# Altium project PCB_Project1.PrjPCB
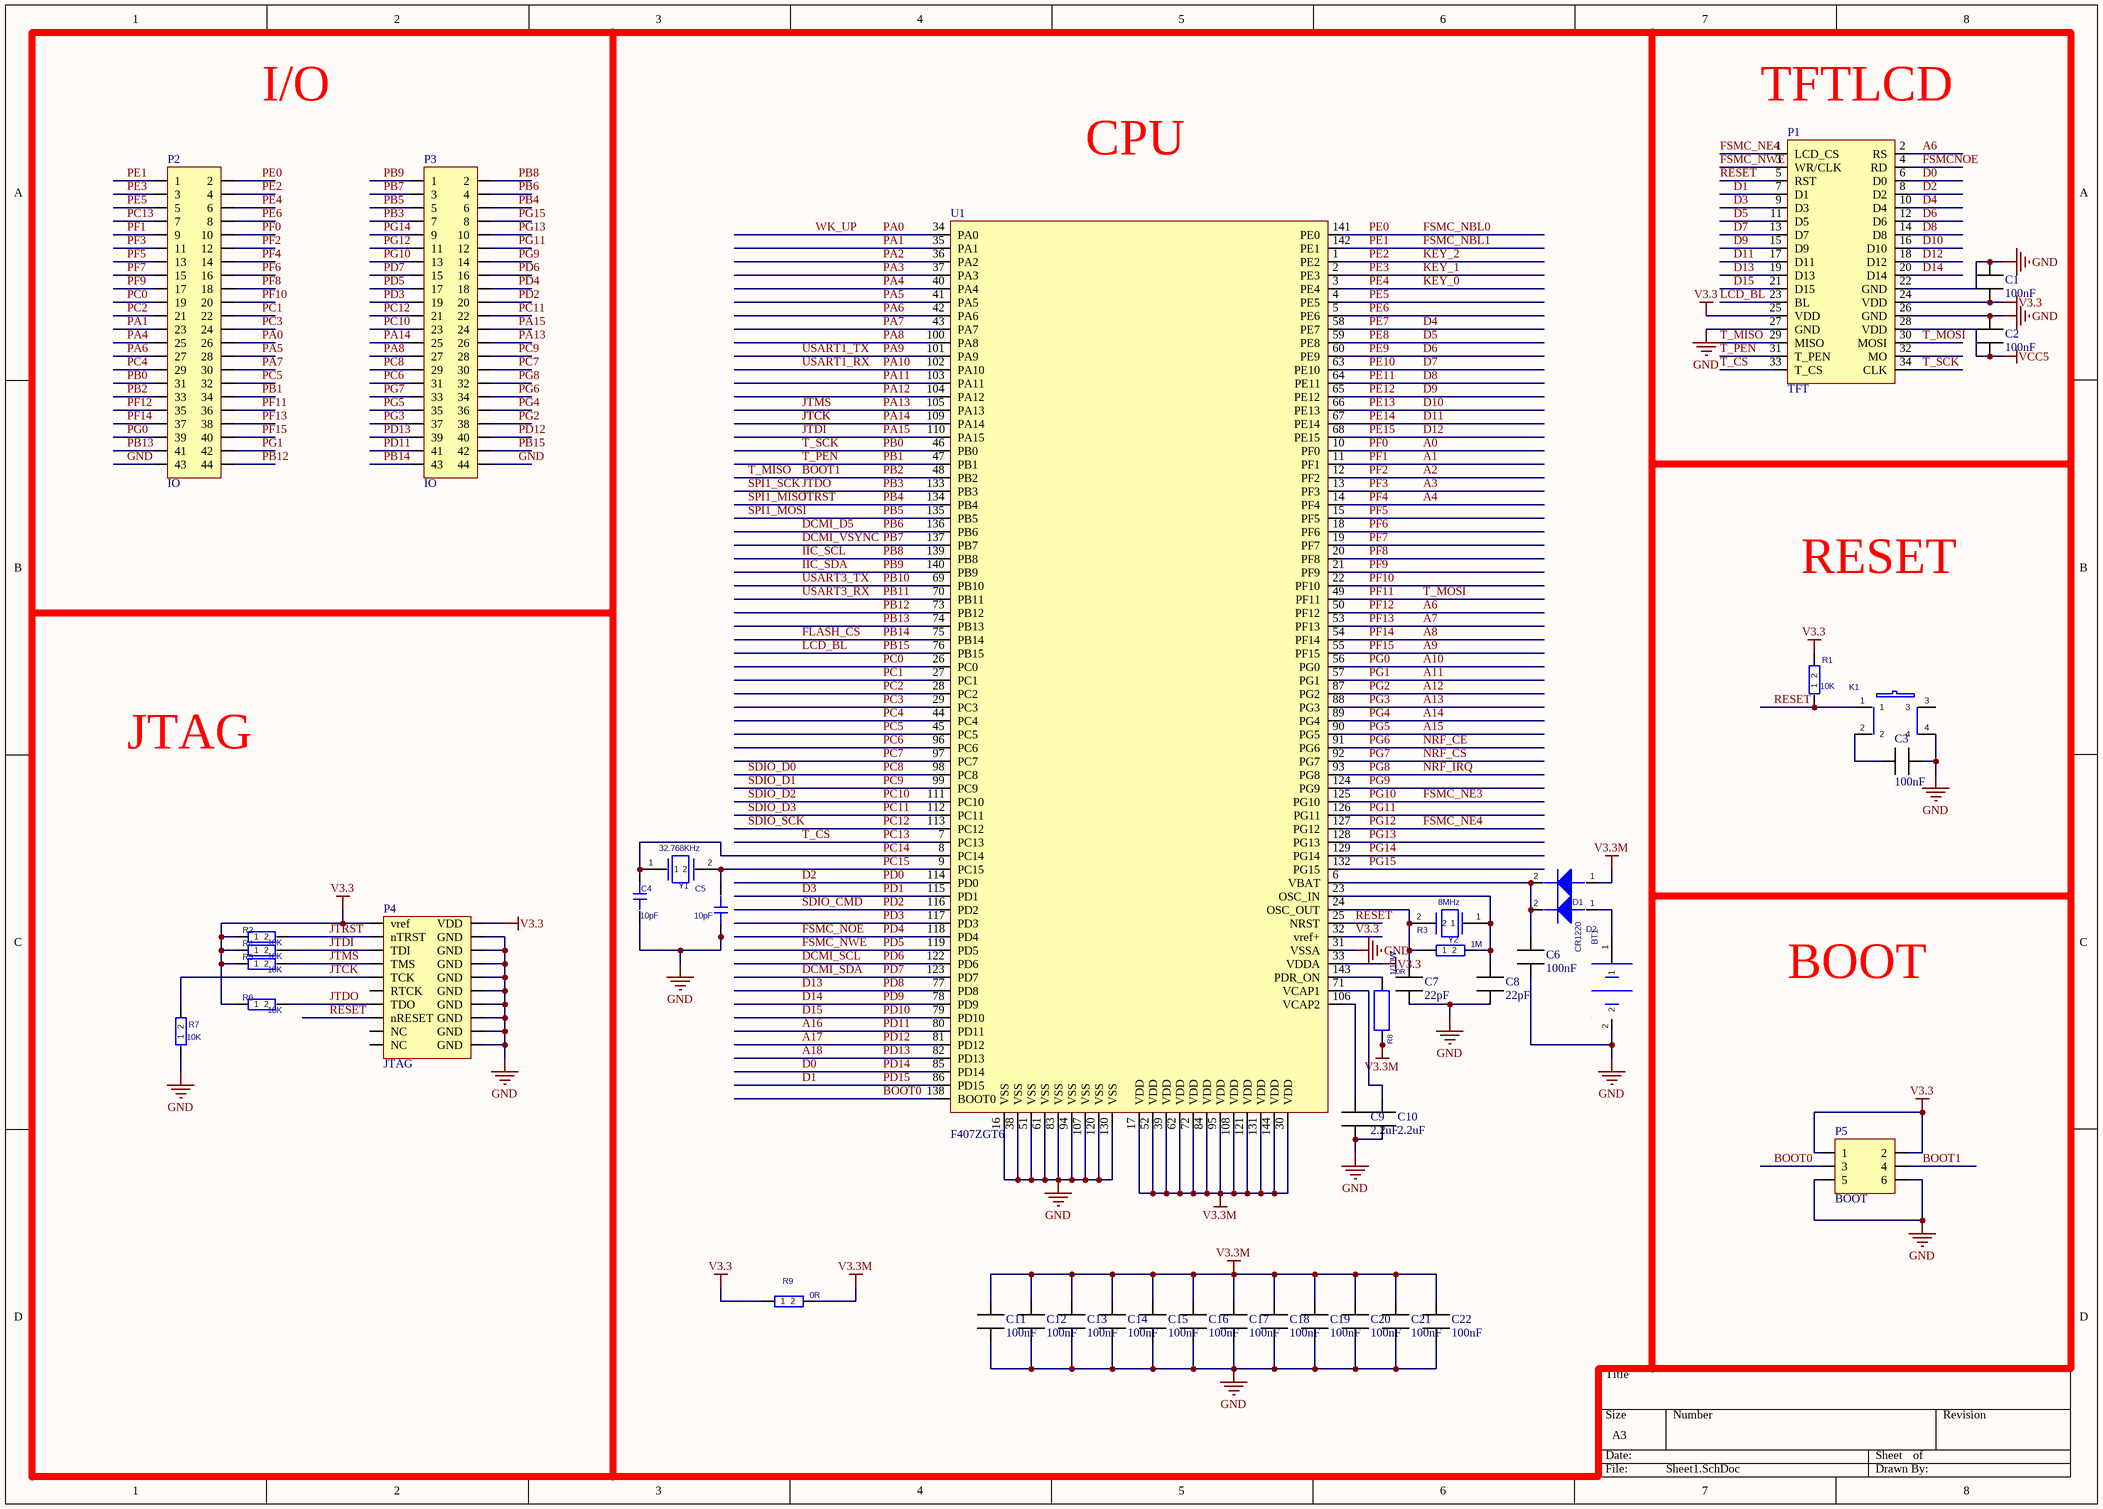
[diagram p0: Sheet1.SchDoc]
2 sheets, 88 parts. Net scope: global (net labels, ports and power ports of the same name join across sheets).
Board file: F407ZGT6.PcbDoc
Sheets:
  Sheet1.SchDoc
  Sheet2.SchDoc

## Sheet Sheet1.SchDoc
size A3

### Parts
BT1  CR1220  [BATERY]
C1  100nF  [CAP_0603_FIRE]
C2  100nF  [CAP_0603_FIRE]
C3  100nF  [CAP_0603_FIRE]
C4  value 10pF  [CAP_0603_FIRE]  (hidden comment: CAP_0.1UF_0603_FIRE)
C5  value 10pF  [CAP_0603_FIRE]  (hidden comment: CAP_0.1UF_0603_FIRE)
C6  100nF  [CAP_0603_FIRE]
C7  22pF  [CAP_0603_FIRE]
C8  22pF  [CAP_0603_FIRE]
C9  2.2uF  [CAP_0603_FIRE]
C10  2.2uF  [CAP_0603_FIRE]
C11  100nF  [CAP_0603_FIRE]
C12  100nF  [CAP_0603_FIRE]
C13  100nF  [CAP_0603_FIRE]
C14  100nF  [CAP_0603_FIRE]
C15  100nF  [CAP_0603_FIRE]
C16  100nF  [CAP_0603_FIRE]
C17  100nF  [CAP_0603_FIRE]
C18  100nF  [CAP_0603_FIRE]
C19  100nF  [CAP_0603_FIRE]
C20  100nF  [CAP_0603_FIRE]
C21  100nF  [CAP_0603_FIRE]
C22  100nF  [CAP_0603_FIRE]
D1  IN4148  [DIODE_SOP]  (value not drawn)
D2  IN4148  [DIODE_SOP]  (value not drawn)
K1  KEY  [SW6.2/6.2-SMD]  (value not drawn)
P1  TFT  [TFT]
P2  IO  [HEAD2*22]
P3  IO  [HEAD2*22]
P4  JTAG  [FC20H]
P5  BOOT  [BOOT]
R1  value 10K  [RES_0603_FIRE]  (hidden comment: RES_1K_0603_FIRE)
R2  value 10K  [RES_0603_FIRE]  (hidden comment: RES_10K_0603_FIRE)
R3  value 1M  [RES_0603_FIRE]  (hidden comment: RES_1K_0603_FIRE)
R4  value 10K  [RES_0603_FIRE]  (hidden comment: RES_10K_0603_FIRE)
R5  value 10K  [RES_0603_FIRE]  (hidden comment: RES_10K_0603_FIRE)
R6  value 10K  [RES_0603_FIRE]  (hidden comment: RES_10K_0603_FIRE)
R7  value 10K  [RES_0603_FIRE]  (hidden comment: RES_10K_0603_FIRE)
R8  value 0R  Power: 1/10W  [0603]  (hidden comment: RES-0603-0R)
R9  value 0R  [RES_0603_FIRE]  (hidden comment: RES_1K_0603_FIRE)
U1  F407ZGT6  [STM32F407ZGT6]
Y1  value 32.768KHz  [CRYS-3X8]  (hidden comment: XTAL_32.768KHZ_FIRE)
Y2  value 8MHz  [CRYSTAL_SMD_FIRE]  (hidden comment: XTAL_8M_FIRE)

### Nets
GND: BT1.2 C1.2 C2.2 C3.1 C4.1 C5.1 C6.1 C7.1 C8.1 C9.1 C10.1 C11.1 C12.1 C13.1 C14.1 C15.1 C16.1 C17.1 C18.1 C19.1 C20.1 C21.1 C22.1 K1.4 P1.22(GND) P1.26(GND) P1.27(GND) P2.43 P3.44 P4.4(GND) P4.6(GND) P4.8(GND) P4.10(GND) P4.12(GND) P4.14(GND) P4.16(GND) P4.18(GND) P4.20(GND) P5.5 P5.6 R7.1 U1.16(VSS) U1.31(VSSA) U1.38(VSS) U1.51(VSS) U1.61(VSS) U1.83(VSS) U1.94(VSS) U1.107(VSS) U1.120(VSS) U1.130(VSS)
V3.3: C1.1 P1.24(VDD) P1.25(VDD) P4.1(vref) P4.2(VDD) P5.1 P5.2 R1.2 R2.1 R4.1 R5.1 R6.1 R9.1 U1.32(vref+) U1.33(VDDA)
V3.3M: C11.2 C12.2 C13.2 C14.2 C15.2 C16.2 C17.2 C18.2 C19.2 C20.2 C21.2 C22.2 D1.1(+) R8.1 R9.2 U1.17(VDD) U1.30(VDD) U1.39(VDD) U1.52(VDD) U1.62(VDD) U1.72(VDD) U1.84(VDD) U1.95(VDD) U1.108(VDD) U1.121(VDD) U1.131(VDD) U1.144(VDD)
VCC5: C2.1 P1.28(VDD)
A0: P2.10 U1.10(PF0)  [also labelled PF0]
A1: P2.9 U1.11(PF1)  [also labelled PF1]
A2: P2.12 U1.12(PF2)  [also labelled PF2]
A3: P2.11 U1.13(PF3)  [also labelled PF3]
A4: P2.14 U1.14(PF4)  [also labelled PF4]
A6: P1.2(RS) P2.35 U1.50(PF12)  [also labelled PF12]
A7: P2.38 U1.53(PF13)  [also labelled PF13]
A8: P2.37 U1.54(PF14)  [also labelled PF14]
A9: P2.40 U1.55(PF15)  [also labelled PF15]
A10: P2.39 U1.56(PG0)  [also labelled PG0]
A11: P2.42 U1.57(PG1)  [also labelled PG1]
A12: P3.38 U1.87(PG2)  [also labelled PG2]
A13: P3.37 U1.88(PG3)  [also labelled PG3]
A14: P3.36 U1.89(PG4)  [also labelled PG4]
A15: P3.35 U1.90(PG5)  [also labelled PG5]
A16: P3.41 U1.80(PD11)  [also labelled PD11]
A17: P3.40 U1.81(PD12)  [also labelled PD12]
A18: P3.39 U1.82(PD13)  [also labelled PD13]
BOOT0: P5.3 U1.138(BOOT0)
BOOT1: P1.29(MISO) P2.33 P5.4 U1.48(PB2)  [also labelled PB2, T_MISO]
D0: P1.6(D0) U1.85(PD14)  [also labelled PD14]
D1: P1.7(D1) U1.86(PD15)  [also labelled PD15]
D2: P1.8(D2) U1.114(PD0)  [also labelled PD0]
D3: P1.9(D3) U1.115(PD1)  [also labelled PD1]
D4: P1.10(D4) U1.58(PE7)  [also labelled PE7]
D5: P1.11(D5) U1.59(PE8)  [also labelled PE8]
D6: P1.12(D6) U1.60(PE9)  [also labelled PE9]
D7: P1.13(D7) U1.63(PE10)  [also labelled PE10]
D8: P1.14(D8) U1.64(PE11)  [also labelled PE11]
D9: P1.15(D9) U1.65(PE12)  [also labelled PE12]
D10: P1.16(D10) U1.66(PE13)  [also labelled PE13]
D11: P1.17(D11) U1.67(PE14)  [also labelled PE14]
D12: P1.18(D12) U1.68(PE15)  [also labelled PE15]
D13: P1.19(D13) U1.77(PD8)  [also labelled PD8]
D14: P1.20(D14) U1.78(PD9)  [also labelled PD9]
D15: P1.21(D15) U1.79(PD10)  [also labelled PD10]
DCMI_D5: P3.4 U1.136(PB6)  [also labelled PB6]
DCMI_SCL: P3.16 U1.122(PD6)  [also labelled PD6]
DCMI_SDA: P3.15 U1.123(PD7)  [also labelled PD7]
DCMI_VSYNC: P3.3 U1.137(PB7)  [also labelled PB7]
FLASH_CS: P3.43 U1.75(PB14)  [also labelled PB14]
FSMC_NBL0: P2.2 U1.141(PE0)  [also labelled PE0]
FSMC_NBL1: P2.1 U1.142(PE1)  [also labelled PE1]
FSMC_NE3: P3.13 U1.125(PG10)  [also labelled PG10]
FSMC_NE4: P1.1(LCD_CS) P3.11 U1.127(PG12)  [also labelled PG12]
FSMC_NOE: P3.18 U1.118(PD4)  [also labelled PD4]
FSMC_NWE: P1.3(WR/CLK) P3.17 U1.119(PD5)  [also labelled PD5]
FSMCNOE: P1.4(RD)
IIC_SCL: P3.2 U1.139(PB8)  [also labelled PB8]
IIC_SDA: P3.1 U1.140(PB9)  [also labelled PB9]
JTCK: P3.25 P4.9(TCK) R7.2 U1.109(PA14)  [also labelled PA14]
JTDI: P3.24 P4.5(TDI) R4.2 U1.110(PA15)  [also labelled PA15]
JTDO: P3.7 P4.13(TDO) R6.2 U1.133(PB3)  [also labelled PB3, SPI1_SCK]
JTMS: P3.26 P4.7(TMS) R5.2 U1.105(PA13)  [also labelled PA13]
JTRST: P3.6 P4.3(nTRST) R2.2 U1.134(PB4)  [also labelled PB4, SPI1_MISO]
KEY_0: P2.6 U1.3(PE4)  [also labelled PE4]
KEY_1: P2.3 U1.2(PE3)  [also labelled PE3]
KEY_2: P2.4 U1.1(PE2)  [also labelled PE2]
LCD_BL: P1.23(BL) P3.42 U1.76(PB15)  [also labelled PB15]
NRF_CE: P3.34 U1.91(PG6)  [also labelled PG6]
NRF_CS: P3.33 U1.92(PG7)  [also labelled PG7]
NRF_IRQ: P3.32 U1.93(PG8)  [also labelled PG8]
PA0: P2.26 U1.34(PA0)  [also labelled WK_UP]
PA1: P2.23 U1.35(PA1)
PA2: U1.36(PA2)
PA3: U1.37(PA3)
PA4: P2.25 U1.40(PA4)
PA5: P2.28 U1.41(PA5)
PA6: P2.27 U1.42(PA6)
PA7: P2.30 U1.43(PA7)
PA8: P3.27 U1.100(PA8)
PA9: U1.101(PA9)  [also labelled USART1_TX]
PA10: U1.102(PA10)  [also labelled USART1_RX]
PA11: U1.103(PA11)
PA12: U1.104(PA12)
PB0: P1.34(CLK) P2.31 U1.46(PB0)  [also labelled T_SCK]
PB1: P1.31(T_PEN) P2.34 U1.47(PB1)  [also labelled T_PEN]
PB5: P3.5 U1.135(PB5)  [also labelled SPI1_MOSI]
PB10: U1.69(PB10)  [also labelled USART3_TX]
PB11: U1.70(PB11)  [also labelled USART3_RX]
PB12: P2.44 U1.73(PB12)
PB13: P2.41 U1.74(PB13)
PC0: P2.19 U1.26(PC0)
PC1: P2.22 U1.27(PC1)
PC2: P2.21 U1.28(PC2)
PC3: P2.24 U1.29(PC3)
PC4: P2.29 U1.44(PC4)
PC5: P2.32 U1.45(PC5)
PC6: P3.31 U1.96(PC6)
PC7: P3.30 U1.97(PC7)
PC8: P3.29 U1.98(PC8)  [also labelled SDIO_D0]
PC9: P3.28 U1.99(PC9)  [also labelled SDIO_D1]
PC10: P3.23 U1.111(PC10)  [also labelled SDIO_D2]
PC11: P3.22 U1.112(PC11)  [also labelled SDIO_D3]
PC12: P3.21 U1.113(PC12)  [also labelled SDIO_SCK]
PC13: P1.33(T_CS) P2.7 U1.7(PC13)  [also labelled T_CS]
PC14: C4.2 U1.8(PC14) Y1.1
PC15: C5.2 U1.9(PC15) Y1.2
PD2: P3.20 U1.116(PD2)  [also labelled SDIO_CMD]
PD3: P3.19 U1.117(PD3)
PE5: P2.5 U1.4(PE5)
PE6: P2.8 U1.5(PE6)
PF5: P2.13 U1.15(PF5)
PF6: P2.16 U1.18(PF6)
PF7: P2.15 U1.19(PF7)
PF8: P2.18 U1.20(PF8)
PF9: P2.17 U1.21(PF9)
PF10: P2.20 U1.22(PF10)
PF11: P1.30(MOSI) P2.36 U1.49(PF11)  [also labelled T_MOSI]
PG9: P3.14 U1.124(PG9)
PG11: P3.12 U1.126(PG11)
PG13: P3.10 U1.128(PG13)
PG14: P3.9 U1.129(PG14)
PG15: P3.8 U1.132(PG15)
RESET: K1.1 P1.5(RST) P4.15(nRESET) R1.1 U1.25(NRST)
NetBT1_1: BT1.1 D2.1(+)
NetC3_2: C3.2 K1.2
NetC6_2: C6.2 D1.2(-) D2.2(-) U1.6(VBAT)
NetC7_2: C7.2 R3.1 U1.24(OSC_OUT) Y2.2
NetC8_2: C8.2 R3.2 U1.23(OSC_IN) Y2.1
NetC9_2: C9.2 U1.106(VCAP2)
NetC10_2: C10.2 U1.71(VCAP1)
NetR8_2: R8.2 U1.143(PDR_ON)

Not connected (* = marked no-connect by the designer): K1 3; P1 32(MO); P4 11(RTCK) 17(NC) 19(NC)

### Notes on the sheet
- I/O
- (near P1) TFTLCD
- CPU
- RESET
- JTAG
- BOOT

### Library data of the parts
C1-C3 C6-C22 = CAP
C4 C5 = CAP_0.1UF_0603_FIRE: SURFACE MOUNT CAPACITOR 0.031 X 0.061 INCHES; PCB DECAL: CAP_0603_FIRE
R1 R3 R9 = RES_1K_0603_FIRE: 0402; Manufacture 1: SUPEROHM; Tolerance: +-5%; Assembly: SMD; PCB DECAL: RES_0603_FIRE
R2 R4-R7 = RES_10K_0603_FIRE: SURFACE MOUNT RESISTOR 0.031 X 0.061 INCHES, 1/10W; Assembly: SMD; PCB DECAL: RES_0603_FIRE
R8 = RES-0603-0R: 0603, 50V, 1/10W, 5%; Partname: 贴片电阻 0603; Part_Number: RE200045-01; Mfr_Part_Number: RS03K104JT; Mfr: Fenghua; Spec: 0R,1/10W,5%,RS03K104JT(风华); Remarks: Checked; Gtech_Number: 50106031003JR1001; Source_Path: D:\CADENCELIB\CAPTURELIB\LC_PASSIVE.OLB; PCB DECAL: 0603; Availability: 0
Y1 = XTAL_32.768KHZ_FIRE: CRYSTAL; PCB DECAL: CRYS-3X8
Y2 = XTAL_8M_FIRE: CRYSTAL; PCB DECAL: CRYSTAL_SMD_FIRE
BT1 = CR1220: PCB DECAL: BATERY
D1 D2 = IN4148: PCB DECAL: DIODE_SOP
K1 = KEY: Manufacturer #1 PN: KEY; PCB DECAL: SW6.2/6.2-SMD

## Sheet Sheet2.SchDoc
size A4
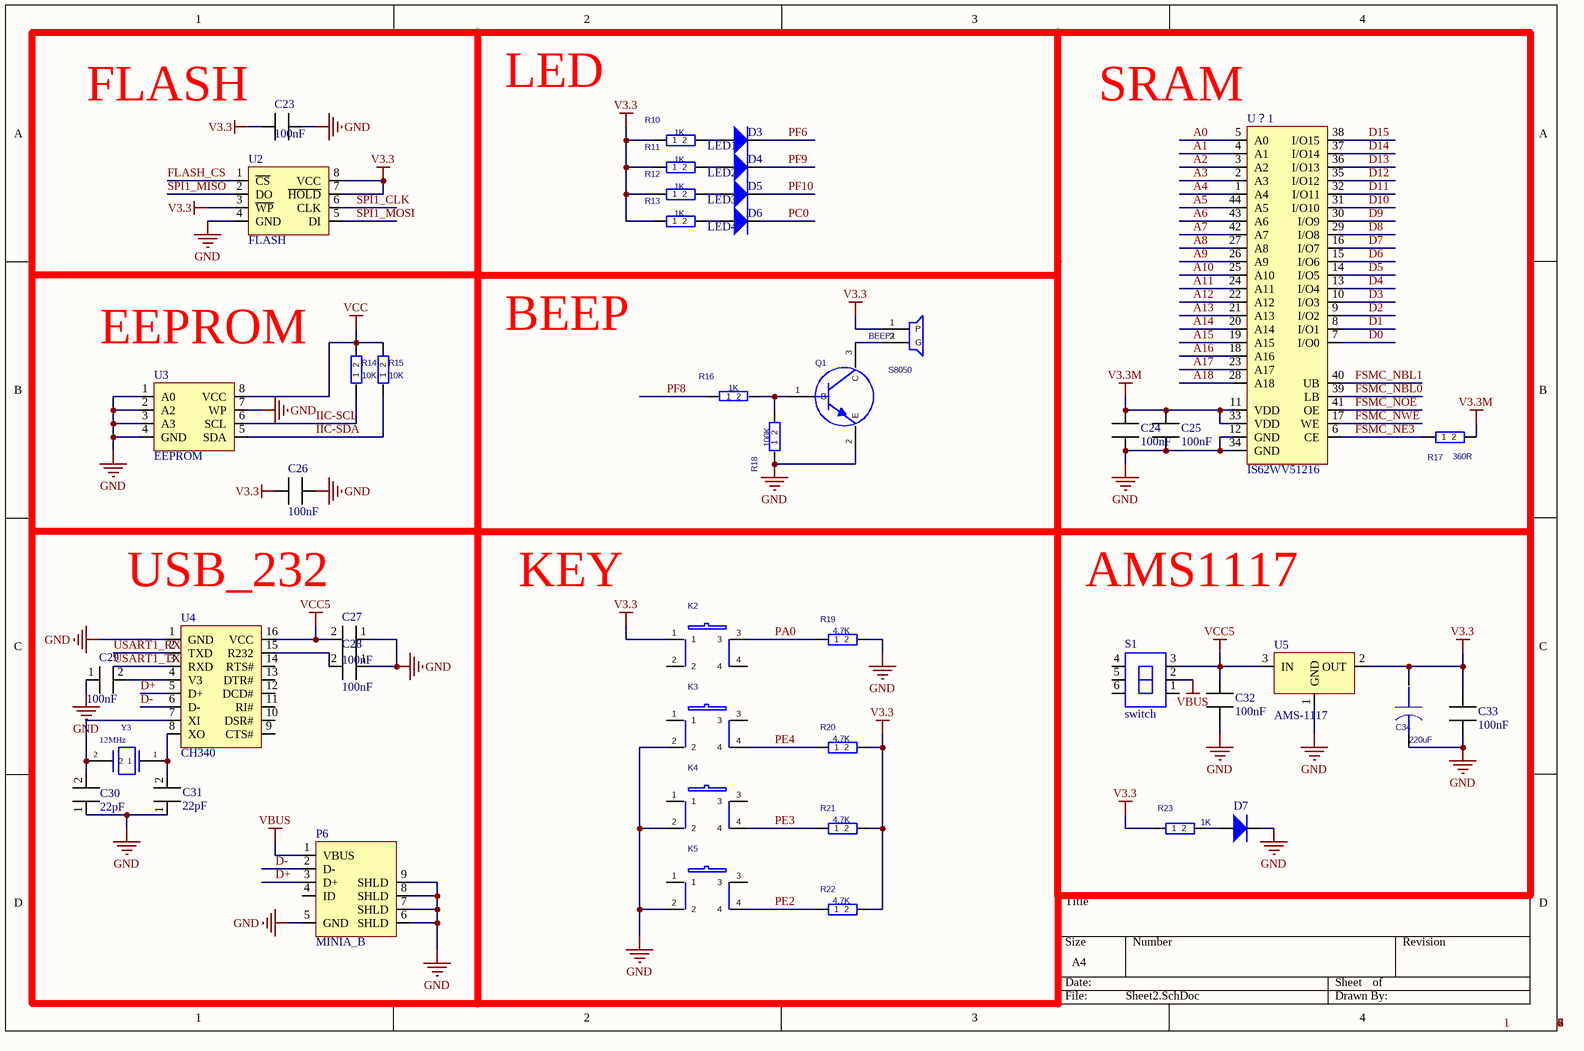
[diagram p1: Sheet2.SchDoc]

### Parts
BEEP1  BEEP-9.5X5.5  [BEEP-9.5X5.5]  (value not drawn)
C23  100nF  [CAP_0603_FIRE]
C24  100nF  [CAP_0603_FIRE]
C25  100nF  [CAP_0603_FIRE]
C26  100nF  [CAP_0603_FIRE]
C27  100nF  [CAP_0603_FIRE]
C28  100nF  [CAP_0603_FIRE]
C29  100nF  [CAP_0603_FIRE]
C30  22pF  [CAP_0603_FIRE]
C31  22pF  [CAP_0603_FIRE]
C32  100nF  [CAP_0603_FIRE]
C33  100nF  [CAP_0603_FIRE]
C34  value 220uF  [CAP+_47UF_FIRE]  (hidden comment: CAP+_47UF_FIRE)
D3  LED1  [DIODE_SOP]
D4  LED2  [DIODE_SOP]
D5  LED3  [DIODE_SOP]
D6  LED4  [DIODE_SOP]
D7  (no value)  [DIODE_SOP]
K2  KEY  [SW6.2/6.2-SMD]  (value not drawn)
K3  KEY  [SW6.2/6.2-SMD]  (value not drawn)
K4  KEY  [SW6.2/6.2-SMD]  (value not drawn)
K5  KEY  [SW6.2/6.2-SMD]  (value not drawn)
P6  MINIA_B  [USB-MINI]
Q1  S8050  [SOT-23]
R10  value 1K  [RES_0603_FIRE]  (hidden comment: RES_1K_0603_FIRE)
R11  value 1K  [RES_0603_FIRE]  (hidden comment: RES_1K_0603_FIRE)
R12  value 1K  [RES_0603_FIRE]  (hidden comment: RES_1K_0603_FIRE)
R13  value 1K  [RES_0603_FIRE]  (hidden comment: RES_1K_0603_FIRE)
R14  value 10K  [RES_0603_FIRE]  (hidden comment: RES_10K_0603_FIRE)
R15  value 10K  [RES_0603_FIRE]  (hidden comment: RES_10K_0603_FIRE)
R16  value 1K  [RES_0603_FIRE]  (hidden comment: RES_100R_0603_FIRE)
R17  value 360R  [RES_0603_FIRE]  (hidden comment: RES_1K_0603_FIRE)
R18  value 100K  [RES_0603_FIRE]  (hidden comment: RES_1K_0603_FIRE)
R19  value 4.7K  [RES_0603_FIRE]  (hidden comment: RES_4K7_0603_FIRE)
R20  value 4.7K  [RES_0603_FIRE]  (hidden comment: RES_4K7_0603_FIRE)
R21  value 4.7K  [RES_0603_FIRE]  (hidden comment: RES_4K7_0603_FIRE)
R22  value 4.7K  [RES_0603_FIRE]  (hidden comment: RES_4K7_0603_FIRE)
R23  value 1K  [RES_0603_FIRE]  (hidden comment: RES_1K_0603_FIRE)
S1  switch  [switch]
U2  FLASH  [SOP8A]
U3  EEPROM  [SOP8]
U4  CH340  [SOP16]
U5  AMS-1117  [AMS-1117-3.3]
U？1  IS62WV51216  [IS62WV51216]
Y3  value 12MHz  [XTAL_SMD]  (hidden comment: XTAL_12M)

### Nets
GND: C23.1 C24.1 C25.1 C26.1 C27.1 C28.1 C29.1 C30.1 C31.1 C32.1 C33.1 C34.2 D7.2 K3.2 K4.2 K5.2 P6.5(GND) P6.6(SHLD) P6.7(SHLD) P6.8(SHLD) P6.9(SHLD) Q1.2(E) R18.1 R19.2 U2.4(GND) U3.1(A0) U3.2(A2) U3.3(A3) U3.4(GND) U3.7(WP) U4.1(GND) U5.1(GND) U？1.12(GND) U？1.34(GND)
V3.3: BEEP1.1(P) C23.2 C26.2 C33.2 C34.1 K2.1 R10.1 R11.1 R12.1 R13.1 R20.2 R21.2 R22.2 R23.1 U2.3(~{WP}) U2.7(~{HOLD}) U2.8(VCC) U5.2(OUT)
V3.3M: C24.2 C25.2 R17.2 U？1.11(VDD) U？1.33(VDD)
VBUS: P6.1(VBUS) S1.2
VCC: R14.2 R15.2 U3.8(VCC)
VCC5: C27.2 C32.2 S1.3 U4.16(VCC) U5.3(IN)
A0: U？1.5(A0)
A1: U？1.4(A1)
A2: U？1.3(A2)
A3: U？1.2(A3)
A4: U？1.1(A4)
A5: U？1.44(A5)
A6: U？1.43(A6)
A7: U？1.42(A7)
A8: U？1.27(A8)
A9: U？1.26(A9)
A10: U？1.25(A10)
A11: U？1.24(A11)
A12: U？1.22(A12)
A13: U？1.21(A13)
A14: U？1.20(A14)
A15: U？1.19(A15)
A16: U？1.18(A16)
A17: U？1.23(A17)
A18: U？1.28(A18)
D0: U？1.7(I/O0)
D1: U？1.8(I/O1)
D2: U？1.9(I/O2)
D3: U？1.10(I/O3)
D4: U？1.13(I/O4)
D5: U？1.14(I/O5)
D6: U？1.15(I/O6)
D7: U？1.16(I/O7)
D8: U？1.29(I/O8)
D9: U？1.30(I/O9)
D10: U？1.31(I/O10)
D11: U？1.32(I/O11)
D12: U？1.35(I/O12)
D13: U？1.36(I/O13)
D14: U？1.37(I/O14)
D15: U？1.38(I/O15)
D+: P6.3(D+) U4.5(D+)
D-: P6.2(D-) U4.6(D-)
FLASH_CS: U2.1(~{CS})
FSMC_NBL0: U？1.39(LB)
FSMC_NBL1: U？1.40(UB)
FSMC_NE3: R17.1 U？1.6(CE)
FSMC_NOE: U？1.41(OE)
FSMC_NWE: U？1.17(WE)
IIC-SCL: R14.1 U3.6(SCL)
IIC-SDA: R15.1 U3.5(SDA)
PA0: K2.3 R19.1
PC0: D6.2
PE2: K5.4 R22.1  [project net KEY_2]
PE3: K4.4 R21.1  [project net KEY_1]
PE4: K3.4 R20.1  [project net KEY_0]
PF6: D3.2
PF8: R16.1
PF9: D4.2
PF10: D5.2
SPI1_CLK: U2.6(CLK)
SPI1_MISO: U2.2(DO)  [project net JTRST]
SPI1_MOSI: U2.5(DI)  [project net PB5]
USART1_RX: U4.2(TXD)  [project net PA10]
USART1_TX: U4.3(RXD)  [project net PA9]
NetBEEP1_2: BEEP1.2(G) Q1.3(C)
NetC28_2: C28.2 U4.15(R232)
NetC29_2: C29.2 U4.4(V3)
NetC30_2: C30.2 U4.7(XI) Y3.2
NetC31_2: C31.2 U4.8(XO) Y3.1
NetD3_1: D3.1 R10.2
NetD4_1: D4.1 R11.2
NetD5_1: D5.1 R12.2
NetD6_1: D6.1 R13.2
NetD7_1: D7.1 R23.2
NetQ1_1: Q1.1(B) R16.2 R18.2

Not connected (* = marked no-connect by the designer): K2 2 4; K3 1 3; K4 1 3; K5 1 3; P6 4(ID); S1 1 4 5 6; U4 9(CTS#) 10(DSR#) 11(RI#) 12(DCD#) 13(DTR#) 14(RTS#)

### Notes on the sheet
- FLASH
- LED
- (near U？1) SRAM
- (near U3) EEPROM
- BEEP
- USB_232
- KEY
- AMS1117
- Labels drawn without touching a wire or pin: 1

### Library data of the parts
C23-C33 = CAP
D3-D7 = LED
Q1 = S8050: NPN; Manufacturer #2: 8050; PCB DECAL: SOT-23
R10-R13 R17 R18 R23 = RES_1K_0603_FIRE: as R1 on sheet Sheet1; PCB DECAL: RES_0603_FIRE
R14 R15 = RES_10K_0603_FIRE: as R2 on sheet Sheet1; PCB DECAL: RES_0603_FIRE
R16 = RES_100R_0603_FIRE: 0402; Manufacture 1: SUPEROHM; Tolerance: +-5%; Assembly: SMD; PCB DECAL: RES_0603_FIRE
R19-R22 = RES_4K7_0603_FIRE: 0402; Manufacture 1: SUPEROHM; Tolerance: +-5%; PCB DECAL: RES_0603_FIRE
BEEP1 = BEEP-9.5X5.5: PCB DECAL: BEEP-9.5X5.5
C34 = CAP+_47UF_FIRE: PCB DECAL: CAP+_47UF_FIRE
K2-K5 = KEY: Manufacturer #1 PN: KEY; PCB DECAL: SW6.2/6.2-SMD
Y3 = XTAL_12M: PCB DECAL: XTAL_SMD

## Nets that join several sheets
GND: Sheet1 (51 pins), Sheet2 (34 pins)
V3.3: Sheet1 (15 pins), Sheet2 (18 pins)
V3.3M: Sheet1 (27 pins), Sheet2 (5 pins)
VCC5: Sheet1 (C2.1 P1.28), Sheet2 (5 pins)
A0: Sheet1 (P2.10 U1.10), Sheet2 (U？1.5)
A1: Sheet1 (P2.9 U1.11), Sheet2 (U？1.4)
A2: Sheet1 (P2.12 U1.12), Sheet2 (U？1.3)
A3: Sheet1 (P2.11 U1.13), Sheet2 (U？1.2)
A4: Sheet1 (P2.14 U1.14), Sheet2 (U？1.1)
A6: Sheet1 (P1.2 P2.35 U1.50), Sheet2 (U？1.43)
A7: Sheet1 (P2.38 U1.53), Sheet2 (U？1.42)
A8: Sheet1 (P2.37 U1.54), Sheet2 (U？1.27)
A9: Sheet1 (P2.40 U1.55), Sheet2 (U？1.26)
A10: Sheet1 (P2.39 U1.56), Sheet2 (U？1.25)
A11: Sheet1 (P2.42 U1.57), Sheet2 (U？1.24)
A12: Sheet1 (P3.38 U1.87), Sheet2 (U？1.22)
A13: Sheet1 (P3.37 U1.88), Sheet2 (U？1.21)
A14: Sheet1 (P3.36 U1.89), Sheet2 (U？1.20)
A15: Sheet1 (P3.35 U1.90), Sheet2 (U？1.19)
A16: Sheet1 (P3.41 U1.80), Sheet2 (U？1.18)
A17: Sheet1 (P3.40 U1.81), Sheet2 (U？1.23)
A18: Sheet1 (P3.39 U1.82), Sheet2 (U？1.28)
D0: Sheet1 (P1.6 U1.85), Sheet2 (U？1.7)
D1: Sheet1 (P1.7 U1.86), Sheet2 (U？1.8)
D2: Sheet1 (P1.8 U1.114), Sheet2 (U？1.9)
D3: Sheet1 (P1.9 U1.115), Sheet2 (U？1.10)
D4: Sheet1 (P1.10 U1.58), Sheet2 (U？1.13)
D5: Sheet1 (P1.11 U1.59), Sheet2 (U？1.14)
D6: Sheet1 (P1.12 U1.60), Sheet2 (U？1.15)
D7: Sheet1 (P1.13 U1.63), Sheet2 (U？1.16)
D8: Sheet1 (P1.14 U1.64), Sheet2 (U？1.29)
D9: Sheet1 (P1.15 U1.65), Sheet2 (U？1.30)
D10: Sheet1 (P1.16 U1.66), Sheet2 (U？1.31)
D11: Sheet1 (P1.17 U1.67), Sheet2 (U？1.32)
D12: Sheet1 (P1.18 U1.68), Sheet2 (U？1.35)
D13: Sheet1 (P1.19 U1.77), Sheet2 (U？1.36)
D14: Sheet1 (P1.20 U1.78), Sheet2 (U？1.37)
D15: Sheet1 (P1.21 U1.79), Sheet2 (U？1.38)
FLASH_CS: Sheet1 (P3.43 U1.75), Sheet2 (U2.1)
FSMC_NBL0: Sheet1 (P2.2 U1.141), Sheet2 (U？1.39)
FSMC_NBL1: Sheet1 (P2.1 U1.142), Sheet2 (U？1.40)
FSMC_NE3: Sheet1 (P3.13 U1.125), Sheet2 (R17.1 U？1.6)
FSMC_NOE: Sheet1 (P3.18 U1.118), Sheet2 (U？1.41)
FSMC_NWE: Sheet1 (P1.3 P3.17 U1.119), Sheet2 (U？1.17)
JTRST: Sheet1 (P3.6 P4.3 R2.2 U1.134), Sheet2 (U2.2)
KEY_0: Sheet1 (P2.6 U1.3), Sheet2 (K3.4 R20.1)
KEY_1: Sheet1 (P2.3 U1.2), Sheet2 (K4.4 R21.1)
KEY_2: Sheet1 (P2.4 U1.1), Sheet2 (K5.4 R22.1)
PA0: Sheet1 (P2.26 U1.34), Sheet2 (K2.3 R19.1)
PA9: Sheet1 (U1.101), Sheet2 (U4.3)
PA10: Sheet1 (U1.102), Sheet2 (U4.2)
PB5: Sheet1 (P3.5 U1.135), Sheet2 (U2.5)
PC0: Sheet1 (P2.19 U1.26), Sheet2 (D6.2)
PF6: Sheet1 (P2.16 U1.18), Sheet2 (D3.2)
PF8: Sheet1 (P2.18 U1.20), Sheet2 (R16.1)
PF9: Sheet1 (P2.17 U1.21), Sheet2 (D4.2)
PF10: Sheet1 (P2.20 U1.22), Sheet2 (D5.2)